# Altium schematic sheet LAN9254_A_P2.SchDoc
size 431 x 279 mm; DocumentNumber: 5; SheetNumber: 5; SheetTotal: 13
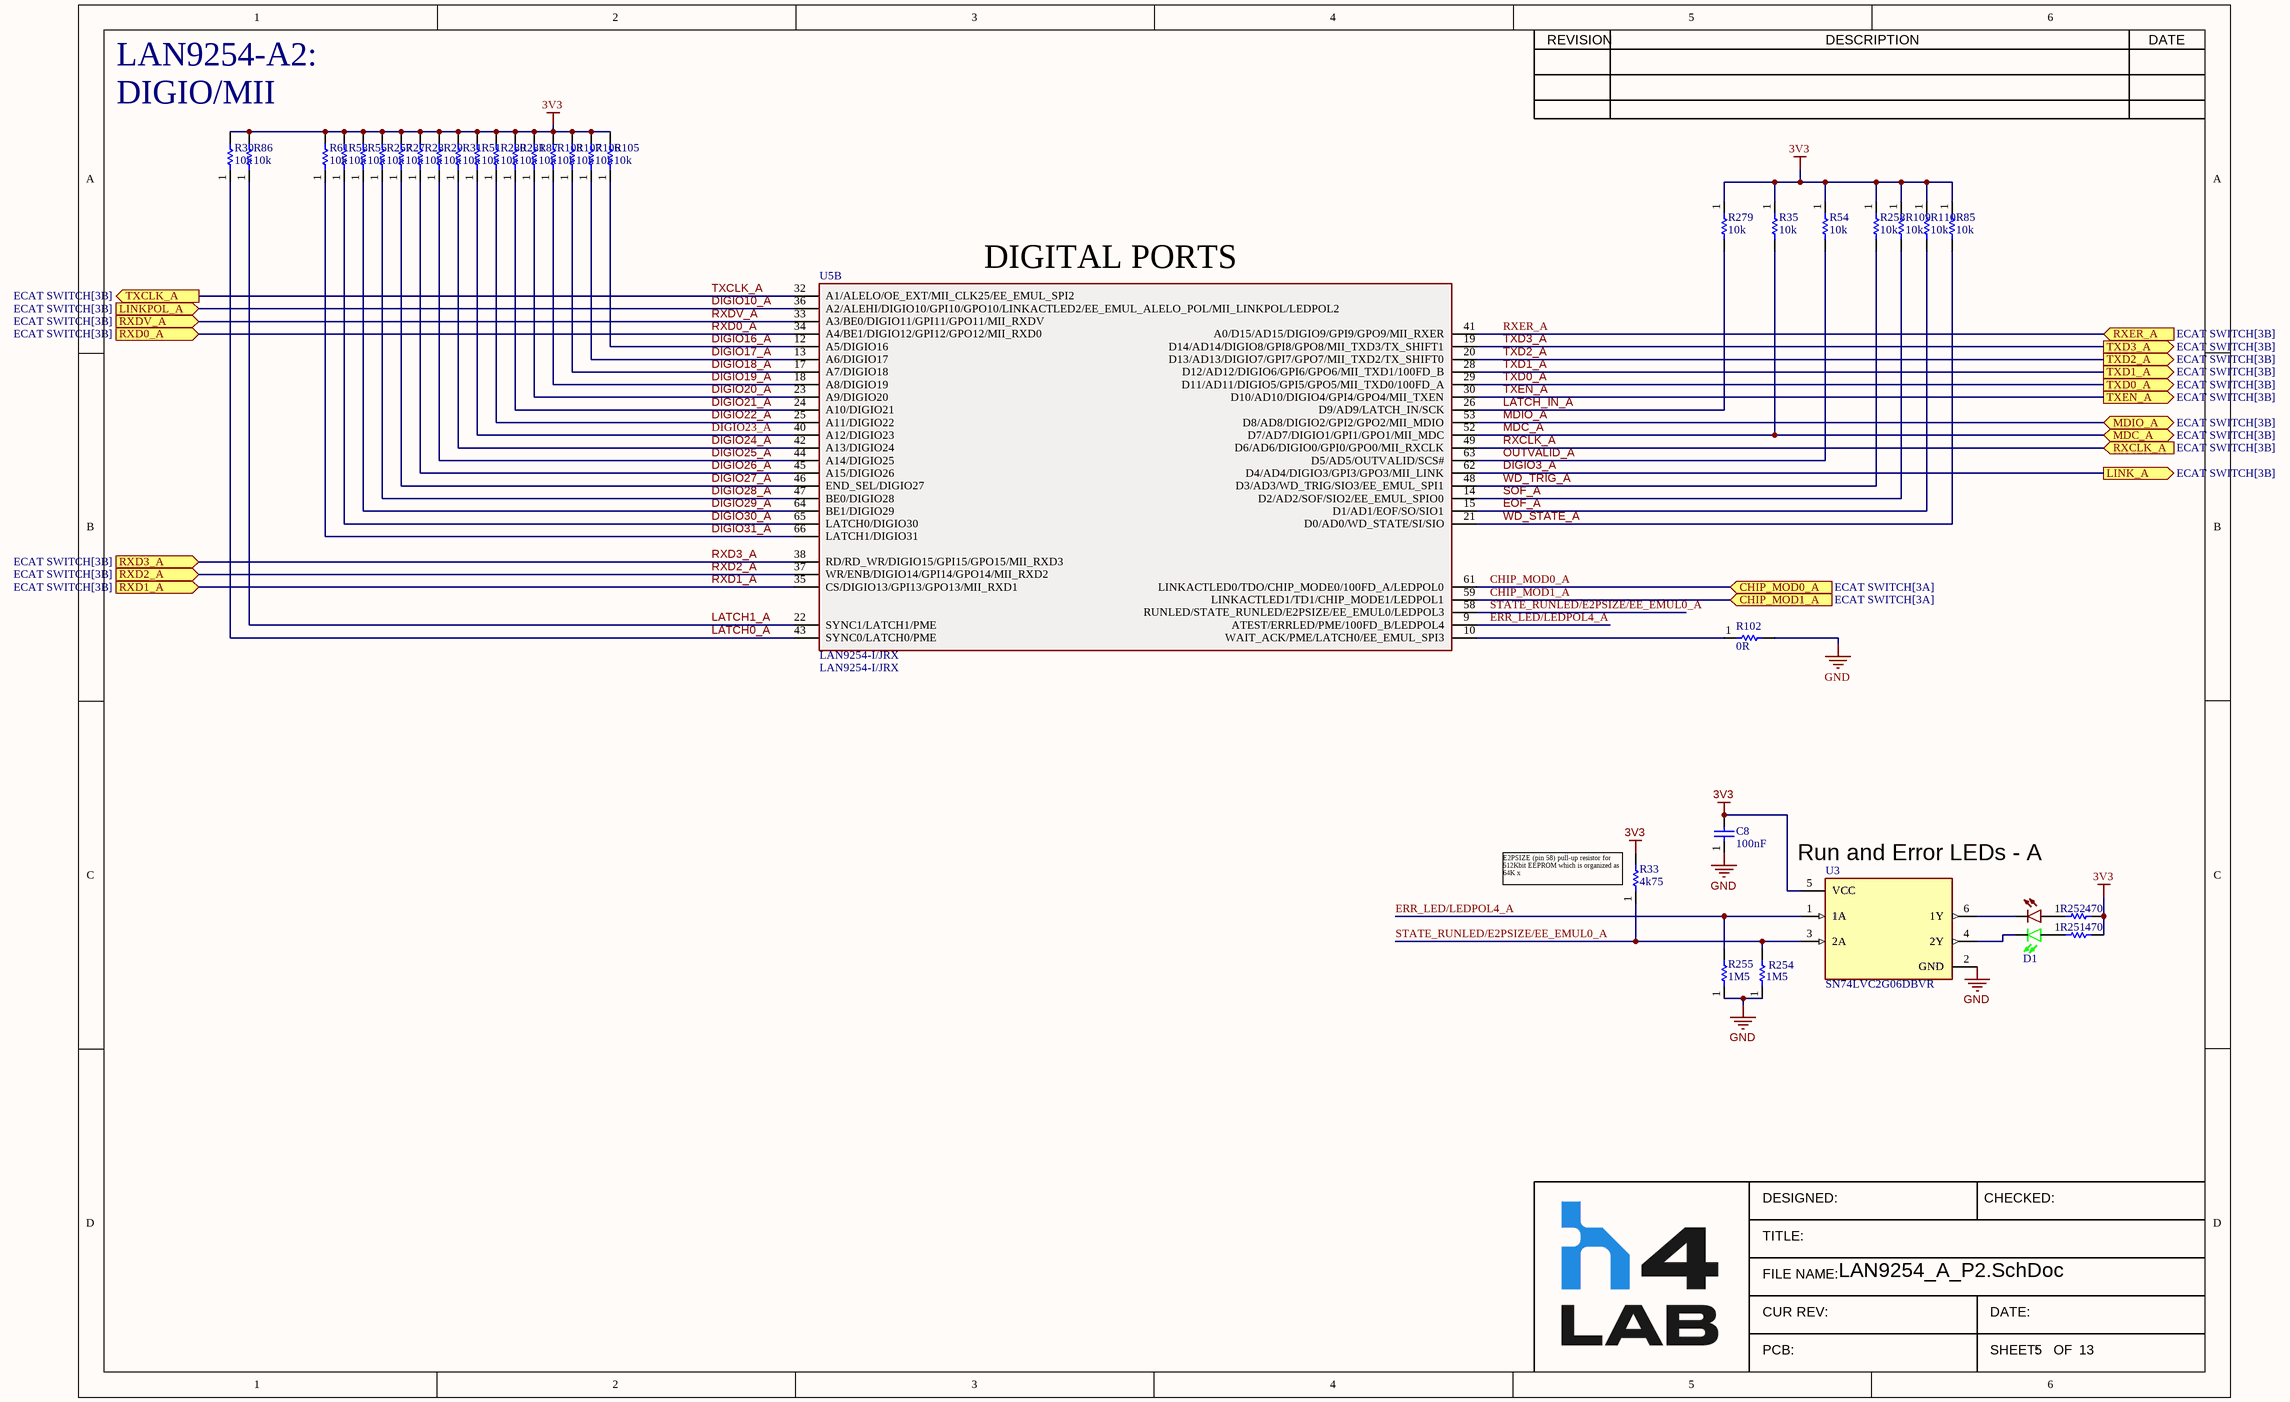
[diagram p0: LAN9254_A_P2.SchDoc]

## Parts
C8  value 100nF  [CAPC1005X03N(0402)]  (hidden comment: GRM155R71C104JA88D)
D1  LTST-C195KGJRKT  [Dual_LED]  (value not drawn)
R27  value 10k  [RESC1005X06N(0402)]  (hidden comment: RC0402FR-0710KL)
R28  value 10k  [RESC1005X06N(0402)]  (hidden comment: RC0402FR-0710KL)
R29  value 10k  [RESC1005X06N(0402)]  (hidden comment: RC0402FR-0710KL)
R30  value 10k  [RESC1005X06N(0402)]  (hidden comment: RC0402FR-0710KL)
R31  value 10k  [RESC1005X06N(0402)]  (hidden comment: RC0402FR-0710KL)
R33  value 4k75  [RESC1005X06N(0402)]  (hidden comment: RC0402FR-074K75L)
R35  value 10k  [RESC1005X06N(0402)]  (hidden comment: RC0402FR-0710KL)
R51  value 10k  [RESC1005X06N(0402)]  (hidden comment: RC0402FR-0710KL)
R54  value 10k  [RESC1005X06N(0402)]  (hidden comment: RC0402FR-0710KL)
R56  value 10k  [RESC1005X06N(0402)]  (hidden comment: RC0402FR-0710KL)
R58  value 10k  [RESC1005X06N(0402)]  (hidden comment: RC0402FR-0710KL)
R61  value 10k  [RESC1005X06N(0402)]  (hidden comment: RC0402FR-0710KL)
R85  value 10k  [RESC1005X06N(0402)]  (hidden comment: RC0402FR-0710KL)
R86  value 10k  [RESC1005X06N(0402)]  (hidden comment: RC0402FR-0710KL)
R87  value 10k  [RESC1005X06N(0402)]  (hidden comment: RC0402FR-0710KL)
R102  value 0R  [0402]  (hidden comment: RCS04020000Z0ED)
R105  value 10k  [RESC1005X06N(0402)]  (hidden comment: RC0402FR-0710KL)
R106  value 10k  [RESC1005X06N(0402)]  (hidden comment: RC0402FR-0710KL)
R107  value 10k  [RESC1005X06N(0402)]  (hidden comment: RC0402FR-0710KL)
R108  value 10k  [RESC1005X06N(0402)]  (hidden comment: RC0402FR-0710KL)
R109  value 10k  [RESC1005X06N(0402)]  (hidden comment: RC0402FR-0710KL)
R110  value 10k  [RESC1005X06N(0402)]  (hidden comment: RC0402FR-0710KL)
R251  value 470  [0402]  (hidden comment: CRCW0402470RJNED)
R252  value 470  [0402]  (hidden comment: CRCW0402470RJNED)
R254  value 1M5  [0402]  (hidden comment: CRCW04021M50JNED)
R255  value 1M5  [0402]  (hidden comment: CRCW04021M50JNED)
R257  value 10k  [RESC1005X06N(0402)]  (hidden comment: RC0402FR-0710KL)
R258  value 10k  [RESC1005X06N(0402)]  (hidden comment: RC0402FR-0710KL)
R279  value 10k  [RESC1005X06N(0402)]  (hidden comment: RC0402FR-0710KL)
R280  value 10k  [RESC1005X06N(0402)]  (hidden comment: RC0402FR-0710KL)
R281  value 10k  [RESC1005X06N(0402)]  (hidden comment: RC0402FR-0710KL)
U3  SN74LVC2G06DBVR  [FP-DBV0006A-IPC_C]
U5  LAN9254-I/JRX  [QFP50P1400X1400X120-81N]  (part B of 2)

## Ports
CHIP_MOD0_A (in, see ECAT SWITCH[3A]), CHIP_MOD1_A (in, see ECAT SWITCH[3A]), LINK_A (out, see ECAT SWITCH[3B]), LINKPOL_A (in, see ECAT SWITCH[3B]), MDC_A (bidir, see ECAT SWITCH[3B]), MDIO_A (bidir, see ECAT SWITCH[3B]), RXCLK_A (in, see ECAT SWITCH[3B]), RXD0_A (in, see ECAT SWITCH[3B]), RXD1_A (in, see ECAT SWITCH[3B]), RXD2_A (in, see ECAT SWITCH[3B]), RXD3_A (in, see ECAT SWITCH[3B]), RXDV_A (in, see ECAT SWITCH[3B]), RXER_A (in, see ECAT SWITCH[3B]), TXCLK_A (out, see ECAT SWITCH[3B]), TXD0_A (out, see ECAT SWITCH[3B]), TXD1_A (out, see ECAT SWITCH[3B]), TXD2_A (out, see ECAT SWITCH[3B]), TXD3_A (out, see ECAT SWITCH[3B]), TXEN_A (out, see ECAT SWITCH[3B])

## Nets
3V3: C8.2 R27.2 R28.2 R29.2 R30.2 R31.2 R33.2 R35.1 R51.2 R54.1 R56.2 R58.2 R61.2 R85.1 R86.2 R87.2 R105.2 R106.2 R107.2 R108.2 R109.1 R110.1 R251.2 R252.2 R257.2 R258.1 R279.1 R280.2 R281.2 U3.5(VCC)
GND: C8.1 R102.2 R254.1 R255.1 U3.2(GND)
CHIP_MOD0_A: U5.61(LINKACTLED0/TDO/CHIP_MODE0/100FD_A/LEDPOL0) ; port CHIP_MOD0_A
CHIP_MOD1_A: U5.59(LINKACTLED1/TD1/CHIP_MODE1/LEDPOL1) ; port CHIP_MOD1_A
DIGIO3_A: U5.62(D4/AD4/DIGIO3/GPI3/GPO3/MII_LINK) ; port LINK_A
DIGIO10_A: U5.36(A2/ALEHI/DIGIO10/GPI10/GPO10/LINKACTLED2/EE_EMUL_ALELO_POL/MII_LINKPOL/LEDPOL2) ; port LINKPOL_A
DIGIO16_A: R105.1 U5.12(A5/DIGIO16)
DIGIO17_A: R106.1 U5.13(A6/DIGIO17)
DIGIO18_A: R107.1 U5.17(A7/DIGIO18)
DIGIO19_A: R108.1 U5.18(A8/DIGIO19)
DIGIO20_A: R87.1 U5.23(A9/DIGIO20)
DIGIO21_A: R281.1 U5.24(A10/DIGIO21)
DIGIO22_A: R280.1 U5.25(A11/DIGIO22)
DIGIO23_A: R51.1 U5.40(A12/DIGIO23)
DIGIO24_A: R31.1 U5.42(A13/DIGIO24)
DIGIO25_A: R29.1 U5.44(A14/DIGIO25)
DIGIO26_A: R28.1 U5.45(A15/DIGIO26)
DIGIO27_A: R27.1 U5.46(END_SEL/DIGIO27)
DIGIO28_A: R257.1 U5.47(BE0/DIGIO28)
DIGIO29_A: R56.1 U5.64(BE1/DIGIO29)
DIGIO30_A: R58.1 U5.65(LATCH0/DIGIO30)
DIGIO31_A: R61.1 U5.66(LATCH1/DIGIO31)
EOF_A: R110.2 U5.15(D1/AD1/EOF/SO/SIO1)
ERR_LED/LEDPOL4_A: R255.2 U3.1(1A) U5.9(ATEST/ERRLED/PME/100FD_B/LEDPOL4)
LATCH0_A: R30.1 U5.43(SYNC0/LATCH0/PME)
LATCH1_A: R86.1 U5.22(SYNC1/LATCH1/PME)
LATCH_IN_A: R279.2 U5.26(D9/AD9/LATCH_IN/SCK)
MDC_A: R35.2 U5.52(D7/AD7/DIGIO1/GPI1/GPO1/MII_MDC) ; port MDC_A
MDIO_A: U5.53(D8/AD8/DIGIO2/GPI2/GPO2/MII_MDIO) ; port MDIO_A
OUTVALID_A: R54.2 U5.63(D5/AD5/OUTVALID/SCS#)
RXCLK_A: U5.49(D6/AD6/DIGIO0/GPI0/GPO0/MII_RXCLK) ; port RXCLK_A
RXD0_A: U5.34(A4/BE1/DIGIO12/GPI12/GPO12/MII_RXD0) ; port RXD0_A
RXD1_A: U5.35(CS/DIGIO13/GPI13/GPO13/MII_RXD1) ; port RXD1_A
RXD2_A: U5.37(WR/ENB/DIGIO14/GPI14/GPO14/MII_RXD2) ; port RXD2_A
RXD3_A: U5.38(RD/RD_WR/DIGIO15/GPI15/GPO15/MII_RXD3) ; port RXD3_A
RXDV_A: U5.33(A3/BE0/DIGIO11/GPI11/GPO11/MII_RXDV) ; port RXDV_A
RXER_A: U5.41(A0/D15/AD15/DIGIO9/GPI9/GPO9/MII_RXER) ; port RXER_A
SOF_A: R109.2 U5.14(D2/AD2/SOF/SIO2/EE_EMUL_SPIO0)
STATE_RUNLED/E2PSIZE/EE_EMUL0_A: R33.1 R254.2 U3.3(2A) U5.58(RUNLED/STATE_RUNLED/E2PSIZE/EE_EMUL0/LEDPOL3)
TXCLK_A: U5.32(A1/ALELO/OE_EXT/MII_CLK25/EE_EMUL_SPI2) ; port TXCLK_A
TXD0_A: U5.29(D11/AD11/DIGIO5/GPI5/GPO5/MII_TXD0/100FD_A) ; port TXD0_A
TXD1_A: U5.28(D12/AD12/DIGIO6/GPI6/GPO6/MII_TXD1/100FD_B) ; port TXD1_A
TXD2_A: U5.20(D13/AD13/DIGIO7/GPI7/GPO7/MII_TXD2/TX_SHIFT0) ; port TXD2_A
TXD3_A: U5.19(D14/AD14/DIGIO8/GPI8/GPO8/MII_TXD3/TX_SHIFT1) ; port TXD3_A
TXEN_A: U5.30(D10/AD10/DIGIO4/GPI4/GPO4/MII_TXEN) ; port TXEN_A
WD_STATE_A: R85.2 U5.21(D0/AD0/WD_STATE/SI/SIO)
WD_TRIG_A: R258.2 U5.48(D3/AD3/WD_TRIG/SIO3/EE_EMUL_SPI1)
NetD1_1: D1.1 R251.1
NetD1_2: D1.2 R252.1
NetD1_3: D1.3 U3.4(2Y)
NetD1_4: D1.4 U3.6(1Y)
NetR102_1: R102.1 U5.10(WAIT_ACK/PME/LATCH0/EE_EMUL_SPI3)

## Notes on the sheet
- LAN9254-A2:
- DIGIO/MII
- (near U5) DIGITAL PORTS
- (near U3) Run and Error LEDs - A
- (near R33) E2PSIZE (pin 58) pull-up resistor for 512Kbit EEPROM which is organized as 64K x
- REVISION
- DESCRIPTION
- DATE
- DESIGNED:
- CHECKED:
- TITLE:
- FILE NAME:
- CUR REV:
- PCB:
- SHEET:
- DATE:
- OF

## Library data of the parts
C8 = 100nF_16V_0402_CAP: CAP CER 0.1UF 16V X7R 0402; Tolerance: 5%; MPN: GRM155R71C104JA88D; Voltage Rating: 16V; Temp Coeff: X7R; Size/Package: 0402
D1 = Green/Red_LED: LED GREEN/RED CLEAR CHIP SMD; Color: Green, Red; Voltage Vf: 2V Green, 2V Red; Current If: 20mA. 20mA; MPN: LTST-C195KGJRKT; Mounting Type: SMD; Supplier 1: Digi-Key; Supplier Part Number 1: 160-1452-1-ND
R27-R31 R35 R51 R54 R56 R58 R61 R85-R87 R105-R110 R257 R258 R279-R281 = 10k_1/16W_0402_RES: RES SMD 10K OHM 1% 1/16W 0402; MPN: RC0402FR-0710KL; Tolerance: 1%; Power: 1/16W; Size: 0402
R33 = 4k75_1/16_0402_RES: RES SMD 4.75K OHM 1% 1/16W 0402; Power: 1/16; MPN: RC0402FR-074K75L; Tolerance: 1%; Package/Case: 0402
R102 = 0R_1/5W_0402_RCS04020000Z0ED_RES: VISHAY - RCS04020000Z0ED - SMD Chip Resistor, 0402 [1005 Metric], 0 ohm, RCS Series, 50 V, Thick Film, 200 mW; Manufacturer: Vishay Dale; Resistance: 0mR; Max Power Dissipation: 200mW; Supplier 1: Digi-Key; Supplier Part Number 1: 541-2877-1-ND; Manufacturer Part Number: RCS04020000Z0ED; RoHS: Yes; Category: Chip SMD Resistors; Stock 1: 18214; Pricing 1: 1=0.10000, 10=0.08300, 25=0.05760, 50=0.04480, 100=0.03200, 250=0.02496, 500=0.01984, 1000=0.01408, 5000=0.01088 (USD); Case/Package: 0402; Case Code (Metric): 1005; Case Code (Imperial): 0402; Min Operating Temperature: -55°C; Max Operating Temperature: 155°C; Packaging: Tape and Reel; Resistor Type: Thick Film; Number of Terminations: 2; Features: Automotive AEC-Q200; Length: 0.039inch; Width: 0.02inch; Height: 0.016inch; RoHS Compliant: Yes; ComponentLink1URL: http://www.farnell.com/datasheets/2618474.pdf?src-supplier=Farnell; ComponentLink1Description: http://www.farnell.com/datasheets/2618474.pdf?src-supplier=Farnell; ComponentLink2URL: http://www.vishay.com/docs/20065/rcse3.pdf?src-supplier=Digi-Key; ComponentLink2Description: http://www.vishay.com/docs/20065/rcse3.pdf?src-supplier=Digi-Key; ComponentLink3URL: http://www.farnell.com/datasheets/2618474.pdf?src-supplier=Element14; ComponentLink3Description: http://www.farnell.com/datasheets/2618474.pdf?src-supplier=Element14; ComponentLink4URL: http://www.farnell.com/datasheets/2618474.pdf?src-supplier=Newark; ComponentLink4Description: http://www.farnell.com/datasheets/2618474.pdf?src-supplier=Newark
R251 R252 = 470_1/10W_0402_CRCW0402470RJNED: Vishay CRCW Series Thick Film Resistor 0402 Case 470 5% 0.063W 200ppm/K; Manufacturer: Vishay Dale; Resistance: 470R; Max Power Dissipation: 63mW; Temperature Coefficient: 200ppm/°C; Voltage Rating: 50V; Supplier 1: Digi-Key; Manufacturer Part Number: CRCW0402470RJNED; RoHS: Yes; Category: Chip SMD Resistors; Pricing 1: 1=0,10000, 10=0,03300, 100=0,01360, 1000=0,00610, 2500=0,00529, 5000=0,00437 (USD); Case/Package: 0402; Number of Pins: 2; Weight: 2.3E-05oz; Case Code (Metric): 1005; Case Code (Imperial): 0402; Contact Plating: Tin; Min Operating Temperature: -55°C; Max Operating Temperature: 155°C; Packaging: Tape and Reel; Tolerance: 5%; Package Quantity: 1; Resistor Type: Thick Film; Number of Terminations: 2; Features: Automotive AEC-Q200; Power Rating: 63mW; Termination: SMD/SMT; Series: CRCW; Voltage Rating (DC): 50V; Resistance Tolerance: 5%; Construction: Rectangular; Technology: THICK FILM; Length: 1mm; Width: 0.02inch; Height: 0.35mm; Depth: 0.5mm; Radiation Hardening: No; RoHS Compliant: Yes; Lead Free: Lead Free; Military Standard: Not; REACH SVHC: Unknown; ComponentLink1URL: https://datasheet.ciiva.com/2461/dcrcwe3-2461992.pdf?src-supplier=Digi-Key; ComponentLink1Description: https://datasheet.ciiva.com/2461/dcrcwe3-2461992.pdf?src-supplier=Digi-Key; ComponentLink2URL: https://datasheet.ciiva.com/2461/dcrcwe3-2461993.pdf?src-supplier=Digi-Key; ComponentLink2Description: https://datasheet.ciiva.com/2461/dcrcwe3-2461993.pdf?src-supplier=Digi-Key; ComponentLink3URL: https://datasheet.ciiva.com/2461/dcrcwe3-2461994.pdf?src-supplier=Digi-Key; ComponentLink3Description: https://datasheet.ciiva.com/2461/dcrcwe3-2461994.pdf?src-supplier=Digi-Key; ComponentLink4URL: https://datasheet.ciiva.com/5550/dcrcwe3-109170-5550440.pdf?src-supplier=Mouser; ComponentLink4Description: https://datasheet.ciiva.com/5550/dcrcwe3-109170-5550440.pdf?src-supplier=Mouser; ComponentLink5URL: https://datasheet.ciiva.com/3256/dcrcwe3-3256554.pdf?src-supplier=Avnet; ComponentLink5Description: https://datasheet.ciiva.com/3256/dcrcwe3-3256554.pdf?src-supplier=Avnet; ComponentLink6URL: https://datasheet.ciiva.com/8336/dcrcwe3-8336717.pdf?src-supplier=Avnet; ComponentLink6Description: https://datasheet.ciiva.com/8336/dcrcwe3-8336717.pdf?src-supplier=Avnet; ComponentLink7URL: https://datasheet.ciiva.com/28571/1847332-28571880.pdf?src-supplier=Element14; ComponentLink7Description: https://datasheet.ciiva.com/28571/1847332-28571880.pdf?src-supplier=Element14; Supplier Part Number 1: 541-470JDKR-ND
R254 R255 = 1M5_1/16W_0402_CRCW04021M50JNED_RES: RES SMD 1.5M OHM 5% 1/16W 0402; Manufacturer: Vishay Dale; Resistance: 1.5MR; Power Rating: 63mW; Voltage Rating: 50V; Temperature Coefficient: 200ppm/°C; Supplier 1: Digi-Key; Manufacturer Part Number: CRCW04021M50JNED; RoHS: Yes; Category: Chip SMD Resistors; Stock 1: 7870; Pricing 1: 1=0,10000, 10=0,03300, 100=0,01360, 1000=0,00610, 2500=0,00529, 5000=0,00437 (USD); Case/Package: 0402; Weight: 2.3E-05oz; Case Code (Imperial): 0402; Case Code (Metric): 1005; Contact Plating: Tin; Min Operating Temperature: -55°C; Max Operating Temperature: 155°C; Tolerance: 5%; Package Quantity: 1; Packaging: Tape and Reel; Termination: SMD/SMT; Resistor Type: Thick Film; Number of Terminations: 2; Max Power Dissipation: 63mW; Voltage Rating (DC): 50V; Features: Automotive AEC-Q200; Series: CRCW; Construction: Rectangular; Length: 1mm; Width: 0.5mm; Height: 0.016inch; Depth: 0.5mm; Radiation Hardening: No; RoHS Compliant: Yes; Military Standard: Not; Lead Free: Lead Free; ComponentLink1URL: https://datasheet.ciiva.com/9100/dcrcwe3-9100251.pdf?src-supplier=Avnet; ComponentLink1Description: https://datasheet.ciiva.com/9100/dcrcwe3-9100251.pdf?src-supplier=Avnet; ComponentLink2URL: https://datasheet.ciiva.com/2493/dcrcwe3-2493529.pdf?src-supplier=Digi-Key; ComponentLink2Description: https://datasheet.ciiva.com/2493/dcrcwe3-2493529.pdf?src-supplier=Digi-Key; ComponentLink3URL: https://datasheet.ciiva.com/2493/dcrcwe3-2493530.pdf?src-supplier=Digi-Key; ComponentLink3Description: https://datasheet.ciiva.com/2493/dcrcwe3-2493530.pdf?src-supplier=Digi-Key; ComponentLink4URL: https://datasheet.ciiva.com/2493/dcrcwe3-2493531.pdf?src-supplier=Digi-Key; ComponentLink4Description: https://datasheet.ciiva.com/2493/dcrcwe3-2493531.pdf?src-supplier=Digi-Key; Supplier Part Number 1: 541-1.5MJCT-ND
U3 = BUF_dual_SN74LVC2G06DBVR: Buffer/Driver 2-CH Inverting Open Drain CMOS 6-Pin SOT-23 T/R; Manufacturer: Texas Instruments; Number of Channels: 2; Propagation Delay: 2.9ns; Min Supply Voltage: 1.65V; High Level Output Current: 32mA; Logic Function: Buffer; Max Supply Voltage: 5.5V; Nominal Supply Current: 40mA; Turn-On Delay Time: 7.2ns; Quiescent Current: 10uA; Number of Inputs: 1; Height: 1.15mm; Radiation Hardening: No; Length: 2.9mm; Number of Output Lines: 2; Package Quantity: 3000; Min Operating Temperature: -40°C; Case/Package: SOT-23; REACH SVHC: No SVHC; Number of Elements: 2; Number of Pins: 6; Mount: Surface Mount; Polarity: Inverting; Contact Plating: Gold; Number of Input Lines: 2; Number of Outputs: 2; Number of Circuits: 2; Number of Gates: 2; Max Operating Temperature: 125°C; RoHS Compliant: Yes; Low Level Output Current: 32mA; Number of Bits: 2; Width: 1.6mm; Packaging: Tape and Reel; Lead Free: Lead Free; Supplier 1: Digi-Key; Manufacturer Part Number: SN74LVC2G06DBVR; RoHS: Yes; Category: Logic Gates; Stock 1: 3468; Pricing 1: 1=0,47000, 10=0,35600, 25=0,32080, 100=0,22150, 250=0,18656, 500=0,15158, 1000=0,11660 (USD); ComponentLink1URL: https://datasheet.ciiva.com/22719/1737061-22719510.pdf?src-supplier=Element14; ComponentLink1Description: https://datasheet.ciiva.com/22719/1737061-22719510.pdf?src-supplier=Element14; ComponentLink2URL: https://datasheet.ciiva.com/7293/sn74lvc2g06-7293674.pdf?src-supplier=Newark; ComponentLink2Description: https://datasheet.ciiva.com/7293/sn74lvc2g06-7293674.pdf?src-supplier=Newark; ComponentLink3URL: https://datasheet.ciiva.com/46439/1786796-46439655.pdf?src-supplier=Element14; ComponentLink3Description: https://datasheet.ciiva.com/46439/1786796-46439655.pdf?src-supplier=Element14; ComponentLink4URL: https://datasheet.ciiva.com/1864/sn74lvc2g06-1864312.pdf?src-supplier=Digi-Key; ComponentLink4Description: https://datasheet.ciiva.com/1864/sn74lvc2g06-1864312.pdf?src-supplier=Digi-Key; ComponentLink5URL: https://datasheet.ciiva.com/1864/sn74lvc2g06-1864311.pdf?src-supplier=Digi-Key; ComponentLink5Description: https://datasheet.ciiva.com/1864/sn74lvc2g06-1864311.pdf?src-supplier=Digi-Key; ComponentLink6URL: https://datasheet.ciiva.com/1864/sn74lvc2g06-1864313.pdf?src-supplier=Digi-Key; ComponentLink6Description: https://datasheet.ciiva.com/1864/sn74lvc2g06-1864313.pdf?src-supplier=Digi-Key; ComponentLink7URL: https://datasheet.ciiva.com/14301/sn74lvc2g06-14301182.pdf?src-supplier=Avnet; ComponentLink7Description: https://datasheet.ciiva.com/14301/sn74lvc2g06-14301182.pdf?src-supplier=Avnet; ComponentLink8URL: https://datasheet.ciiva.com/26220/sn74lvc2g06-26220937.pdf?src-supplier=Avnet+Europe; ComponentLink8Description: https://datasheet.ciiva.com/26220/sn74lvc2g06-26220937.pdf?src-supplier=Avnet+Europe; Supplier Part Number 1: 296-13492-1-ND
U5 = LAN9254-I/JRX: 2/3-PORT Ethercat Slave Controller With 32 Digios With Integrated Ethernet Phys; Manufacturer: Microchip; Supplier 1: Digi-Key; Manufacturer Part Number: LAN9254-I/JRX; RoHS: Yes; Pricing 1: 1=14.24000, 25=12.99000 (USD); RoHS Compliant: Yes; Supplier Part Number 1: 150-LAN9254-I/JRX-ND